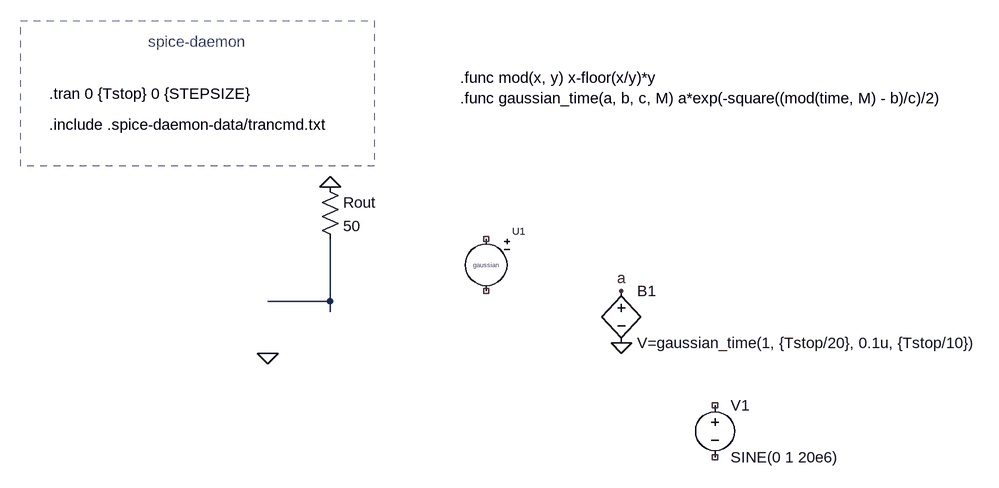
[diagram p0: schematic snspi_test.asc]
snspi_test.asc, the LTspice schematic file:
Version 4
SHEET 1 1700 1200
WIRE 672 944 672 848
WIRE 672 944 576 944
WIRE 672 960 672 944
FLAG 1120 1008 0
FLAG 672 768 0
FLAG 576 1024 0
FLAG 1120 928 a
SYMBOL gaussian 912 848 R0
SYMATTR InstName U1
SYMBOL Res 656 752 R0
SYMATTR InstName Rout
SYMATTR Value 50
SYMBOL bv 1120 912 R0
SYMATTR InstName B1
SYMATTR Value V=gaussian_time(1, {Tstop/20}, 0.1u, {Tstop/10})
SYMBOL Voltage 1264 1088 R0
SYMATTR InstName V1
SYMATTR Value SINE(0 1 20e6)
TEXT 240 672 Left 2 !.include .spice-daemon-data/trancmd.txt
TEXT 392 544 Left 2 ;spice-daemon
TEXT 240 624 Left 2 !.tran 0 {Tstop} 0 {STEPSIZE}
TEXT 872 600 Left 2 !.func mod(x, y) x-floor(x/y)*y\n.func gaussian_time(a, b, c, M) a*exp(-square((mod(time, M) - b)/c)/2)
RECTANGLE Normal 740 736 196 512 2

The netlist it stands for:
* snspi_test.asc
XU1 NC_01 NC_02 gaussian  ; pins in out
Rout 0 N001 50
B1 a 0 V=gaussian_time(1, {Tstop/20}, 0.1u, {Tstop/10})
V1 NC_03 NC_04 SINE(0 1 20e6)
.include .spice-daemon-data/trancmd.txt
* spice-daemon
.tran 0 {Tstop} 0 {STEPSIZE}
.func mod(x, y) x-floor(x/y)*y
.func gaussian_time(a, b, c, M) a*exp(-square((mod(time, M) - b)/c)/2)
.lib /Users/torque/programs/meng-thesis/noise+psd/.spice-daemon-data/spice-daemon.lib
.backanno
.end